# EasyEDA Pro project VoidX-Mini-Stomp-X.eprj, board NEW_PCB
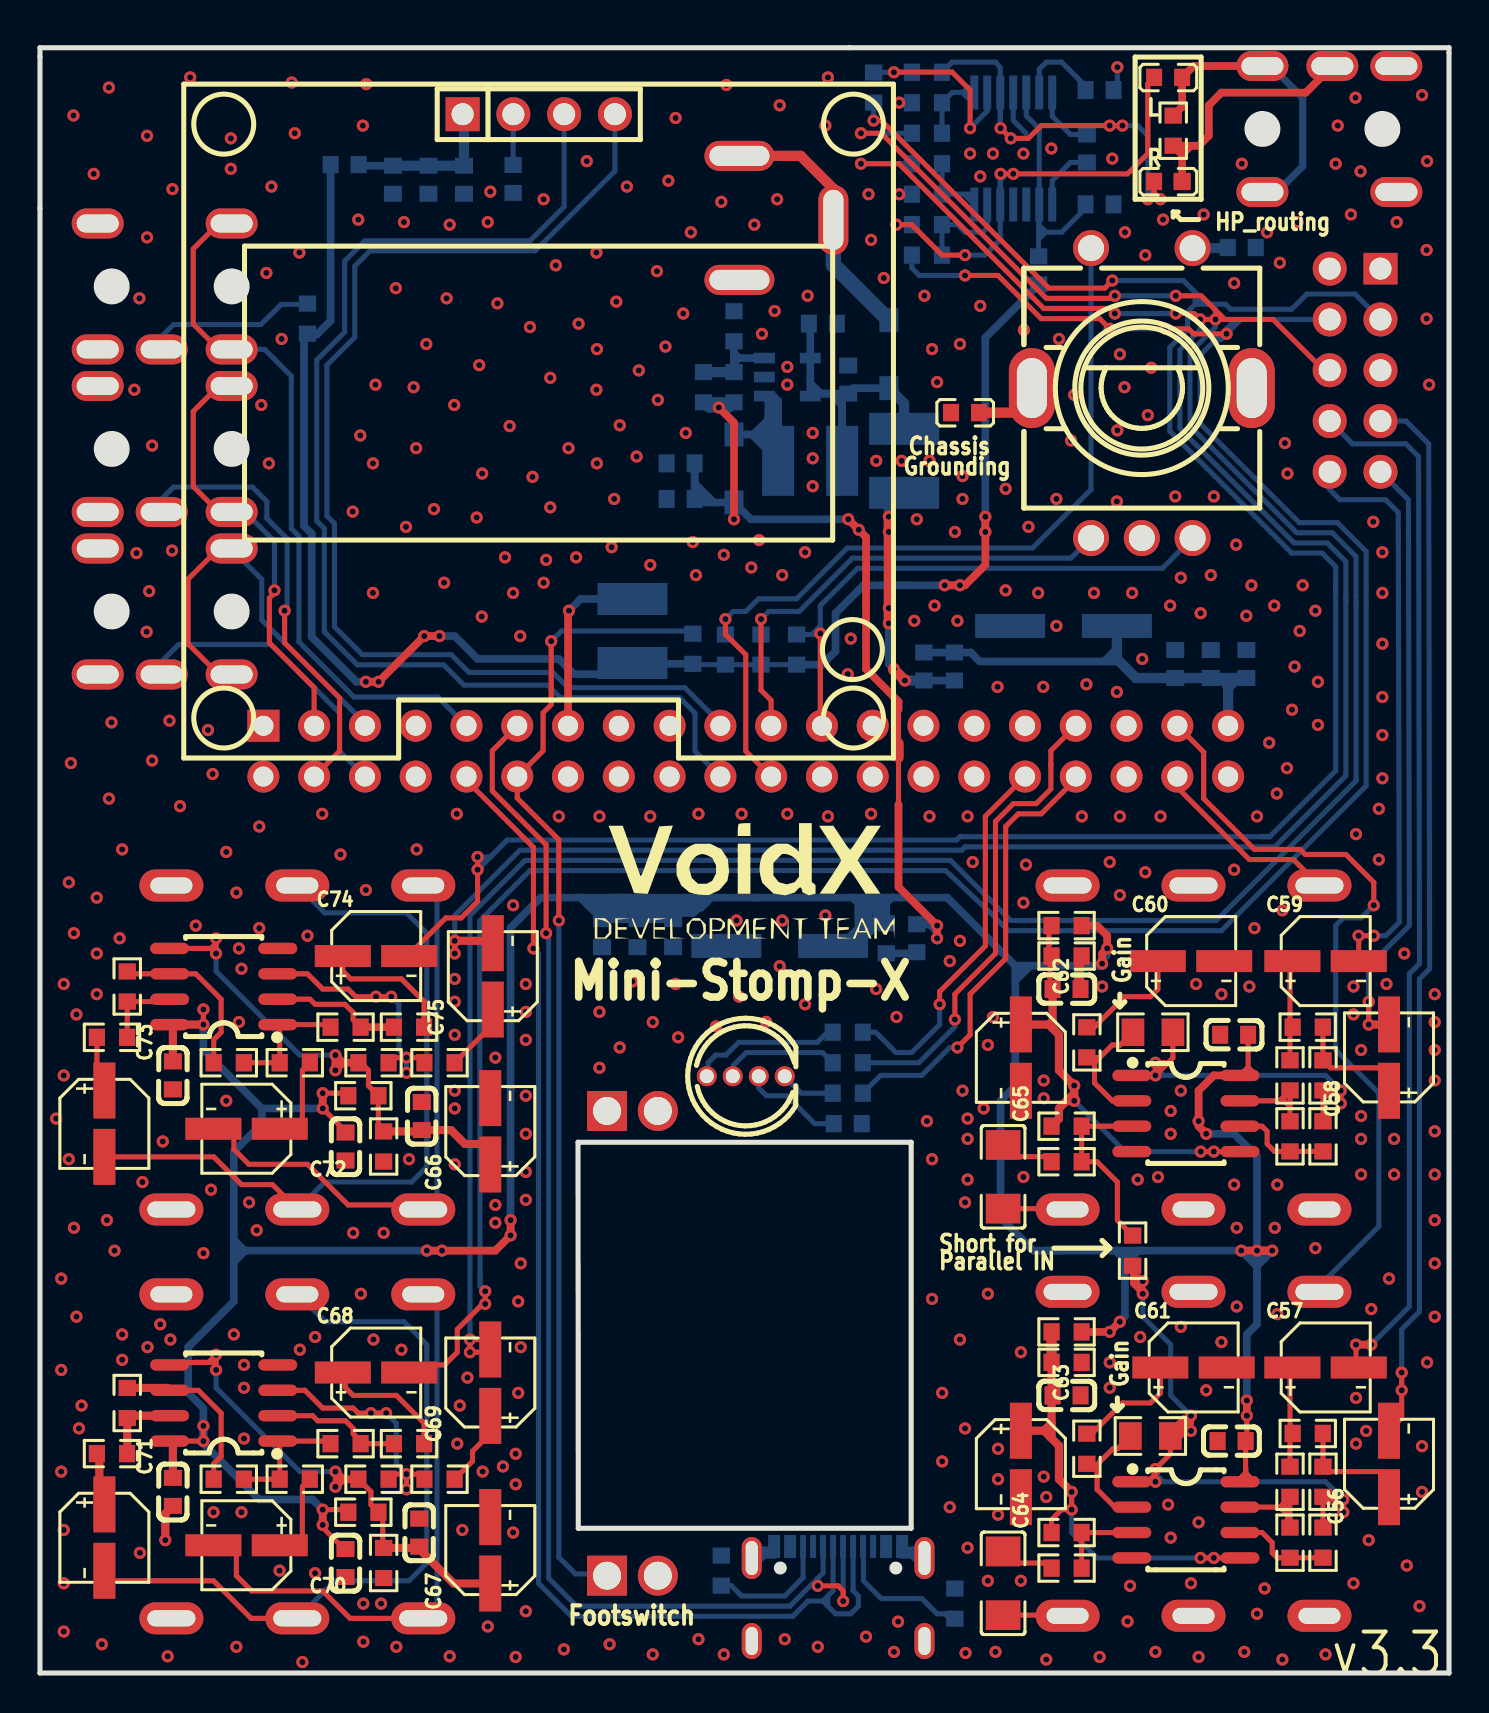
[diagram p1: board, top side]
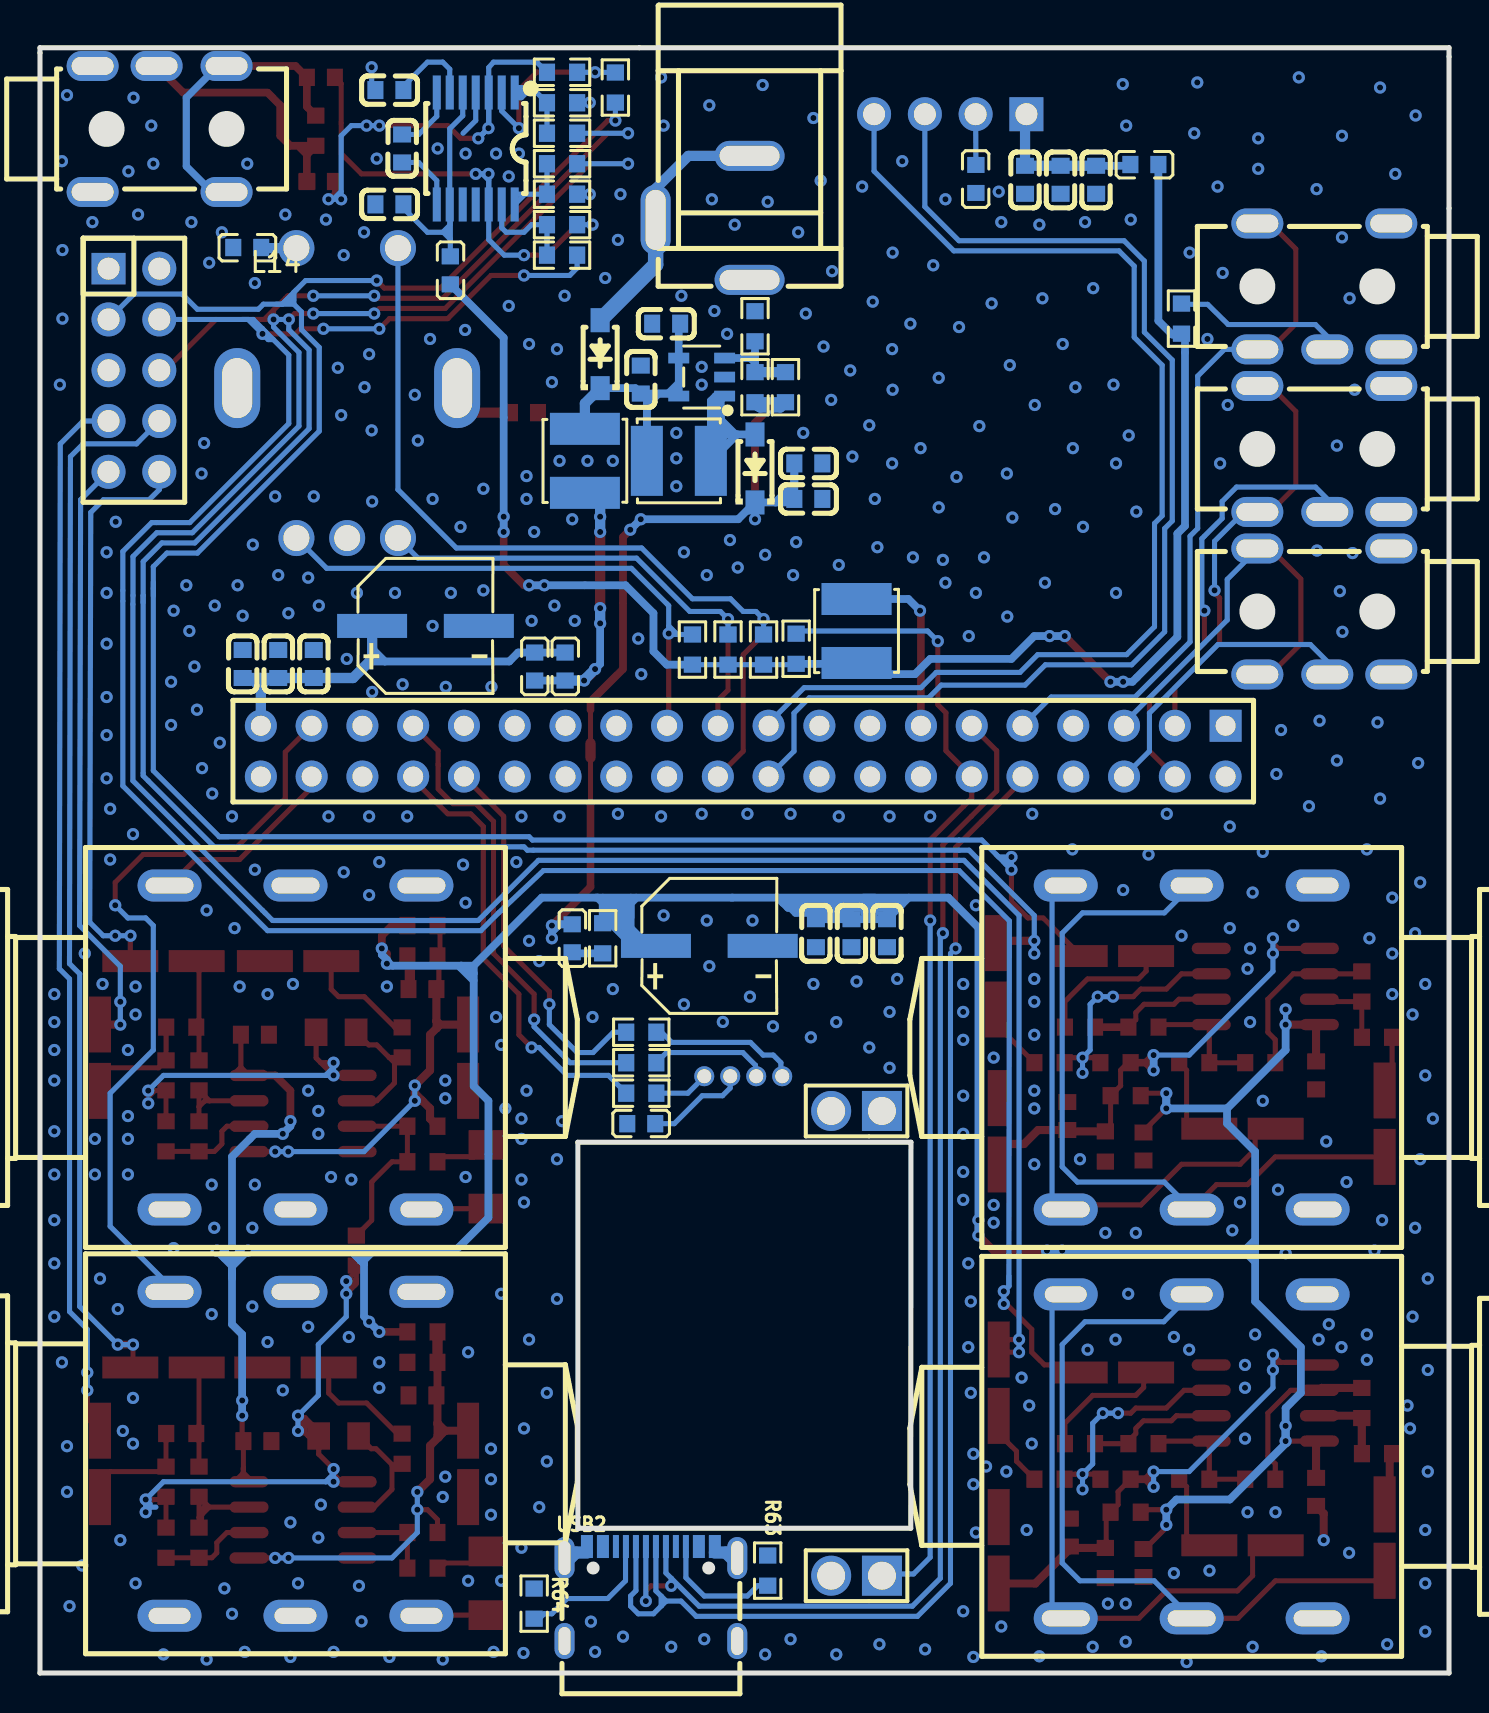
[diagram p2: board, bottom side, seen from below]

Outline 70.48 x 81.28 mm; copper layers: Top Layer, Bottom Layer. Coordinates in mm from the lower left corner of the outline.
Outline path: 0,81.28 0,0 70.48,0 70.48,81.28 0,81.28 ; 26.92,26.54 43.58,26.54 43.58,7.24 26.93,7.24 26.92,26.54
Stack: Top Layer 0.035mm / Dielectric1 1.51mm FR4 er 4.5 / Bottom Layer 0.035mm

## Design rules (mm)
spacing Default (default): track to track 0.152, other pairs 0 to 0.152
track width Default (default): min 0.254, default 0.254, max 25.4
differential pair differentialPair (default): width min 0.127, default 0.254, max 2.54; gap min 0.152, default 0.152
via Default (default): diameter min 0.605, default 0.605, max 100.025; hole min 0.305, default 0.305, max 59.995
net GND uses gge24461(1)
net ISOLATE_HP uses gge193373
net ISOLATE_DRE uses gge193508
pour e831 uses gge24461
pour e832 uses gge193373
pour e1608 uses gge24461(1)

## Placement (name value [footprint] x y rotation side)
C3  10uF  [C0603]  17.65 74.68 90 bottom
C4  100nF  [C0603]  21.21 74.68 90 bottom
C5  1uF  [C0603]  19.43 74.68 90 bottom
C6  220uF  [CAP-SMD_BD6.3-L6.6-W6.6-FD]  51.2 52.36 180 bottom
C8  1uF  [C0603]  29.89 37 90 bottom
C9  100nF  [C0603]  31.67 37 90 bottom
C10  10uF  [C0603]  28.11 37 90 bottom
C11  100nF  [C0603]  51.35 13.88 180 top
C15  1uF  [C0603]  6.65 29.89 90 top
C16  100nF  [C0603]  15.29 26.33 90 top
C18  100nF  [C0603]  51.35 34.2 180 top
C21  1uF  [C0603]  59.61 11.6 0 top
C22  1uF  [C0603]  59.74 31.92 0 top
C27  10uF  [C0603]  40.43 64.68 270 bottom
C28  1uF  [C0603]  39.16 67.48 0 bottom
C32  100nF  [C0603]  19.1 27.85 90 top
C35  10uF  [C0603]  32.05 60.49 0 bottom
C37  1uF  [C0603]  53.01 79.16 0 bottom
C39  10uF  [C0603]  56.79 50.46 270 bottom
C40  100nF  [C0603]  60.35 50.46 270 bottom
C41  1uF  [C0603]  58.57 50.46 270 bottom
C42  100nF  [C0603]  18.97 7.02 90 top
C45  100nF  [C0603]  15.29 5.5 90 top
C46  1uF  [C0603]  6.65 9.06 90 top
C48  1uF  [C0603]  32.05 58.71 0 bottom
C49  1uF  [C0603]  52.37 76.24 270 bottom
C50  1uF  [C0603]  53.01 73.45 0 bottom
C55  220uF  [CAP-SMD_BD6.3-L6.6-W6.6-FD]  37 36.36 180 bottom
C56  10uF  [CAP-SMD_BD4.0-L4.3-W4.3-LS5.0-FD]  67.48 10.45 90 top
C57  10uF  [CAP-SMD_BD4.0-L4.3-W4.3-LS5.0-FD]  64.31 15.28 0 top
C58  10uF  [CAP-SMD_BD4.0-L4.3-W4.3-LS5.0-FD]  67.48 30.77 90 top
C59  10uF  [CAP-SMD_BD4.0-L4.3-W4.3-LS5.0-FD]  64.31 35.6 0 top
C60  10uF  [CAP-SMD_BD4.0-L4.3-W4.3-LS5.0-FD]  57.58 35.6 0 top
C61  10uF  [CAP-SMD_BD4.0-L4.3-W4.3-LS5.0-FD]  57.7 15.28 0 top
C62  10uF  [CAP-SMD_BD4.0-L4.3-W4.3-LS5.0-FD]  49.07 30.77 270 top
C63  10uF  [CAP-SMD_BD4.0-L4.3-W4.3-LS5.0-FD]  49.07 10.45 270 top
C64  100nF  [C1206]  48.18 4.49 270 top
C65  100nF  [C1206]  48.18 24.82 270 top
C66  10uF  [CAP-SMD_BD4.0-L4.3-W4.3-LS5.0-FD]  22.52 27.09 90 top
C67  10uF  [CAP-SMD_BD4.0-L4.3-W4.3-LS5.0-FD]  22.52 6.14 90 top
C68  10uF  [CAP-SMD_BD4.0-L4.3-W4.3-LS5.0-FD]  16.81 15.03 0 top
C69  10uF  [CAP-SMD_BD4.0-L4.3-W4.3-LS5.0-FD]  22.52 14.52 90 top
C70  10uF  [CAP-SMD_BD4.0-L4.3-W4.3-LS5.0-FD]  10.33 6.39 180 top
C71  10uF  [CAP-SMD_BD4.0-L4.3-W4.3-LS5.0-FD]  3.22 6.77 270 top
C72  10uF  [CAP-SMD_BD4.0-L4.3-W4.3-LS5.0-FD]  10.33 27.22 180 top
C73  10uF  [CAP-SMD_BD4.0-L4.3-W4.3-LS5.0-FD]  3.22 27.47 270 top
C74  10uF  [CAP-SMD_BD4.0-L4.3-W4.3-LS5.0-FD]  16.81 35.85 0 top
C75  10uF  [CAP-SMD_BD4.0-L4.3-W4.3-LS5.0-FD]  22.65 34.84 90 top
D1  B5819W_C8598  [SOD-123_L2.7-W1.6-LS3.7-RD-1]  42.46 65.95 90 bottom
D2  B5819W_C8598  [SOD-123_L2.7-W1.6-LS3.7-RD-1]  34.72 60.24 90 bottom
DC2  DC-470-2.1GP  [DC-IN-TH_DC-470-2.1GP]  37.34 72.77 270 bottom
H1  PZ254V-11-02P  [HDR-TH_2P-P2.54-V-M]  29.64 4.87 0 bottom
H2  PM254V-12-10P-H85  [HDR-TH_10P-P2.54-V-F-R2-C5-S2.54]  65.79 65.15 270 bottom
H3  PZ254V-11-02P  [HDR-TH_2P-P2.54-V-M]  29.64 28.11 0 bottom
J1  PJ313D  [AUDIO-TH_PJ313D]  6.24 61.21 0 bottom
J2  PJ313D  [AUDIO-TH_PJ313D]  6.24 53.09 0 bottom
J3  PJ313D  [AUDIO-TH_PJ313D]  6.24 69.34 0 bottom
J4  PJ313D  [AUDIO-TH_PJ313D]  64.5 77.22 180 bottom
J5  PJ-609BA  [AUDIO-TH_PJ-609BA]  57.7 31.28 180 bottom
J6  PJ-609BA  [AUDIO-TH_PJ-609BA]  57.7 10.96 180 bottom
J7  PJ-609BA  [AUDIO-TH_PJ-609BA]  12.87 31.28 0 bottom
J8  PJ-609BA  [AUDIO-TH_PJ-609BA]  12.87 10.84 0 bottom
L1  600Ω  [L0603]  15.24 75.44 0 bottom
L2  600Ω  [L0603]  43.86 36.74 270 bottom
L3  600Ω  [L0603]  45.74 50.33 270 bottom
L4  600Ω  [L0603]  44.22 50.33 270 bottom
L5  10uH  [IND-SMD_L4.0-W4.0]  38.53 60.62 0 bottom
L6  600Ω  [L0603]  40.41 27.47 180 bottom
L7  600Ω  [L0603]  49.96 70.14 270 bottom
L8  600Ω  [L0603]  56.43 79.8 180 top
L9  600Ω  [L0603]  56.43 74.59 180 top
L10  600Ω  [L0603]  46.27 63.03 180 top
L11  600Ω  [L0603]  23.67 74.72 90 bottom
L12  10uH  [IND-SMD_L4.0-W4.0]  43.23 60.62 90 bottom
L13  10uH  [IND-SMD_L4.0-W4.0]  29.64 52.11 90 bottom
L14  600Ω  [L0603]  60.12 71.29 0 bottom
LED1  TJ-L5FYTXHMCSLCRGB-A5  [LED-TH_4P-BD5.8-P1.30]  35.31 29.84 0 top
NOREF  -  [Pad_e1610]  57.13 74.59 270 top
OLED1  -  [1.3-OLED-BLUE]  24.89 64.01 0 top
P1  Header-Female-2.54_2x20  [HDR-TH_40P-P2.54-V-F-R2-C20-S2.54]  35.31 46.1 0 bottom
R1  56kΩ  [R0603]  44.37 77 0 bottom
R2  56kΩ  [R0603]  41.7 79.29 90 bottom
R3  22kΩ  [R0603]  51.35 15.53 180 top
R4  22kΩ  [R0603]  51.35 17.06 180 top
R5  4.7Ω  [R0603]  42.34 36.74 90 bottom
R6  22kΩ  [R0603]  51.35 37.38 180 top
R7  22kΩ  [R0603]  51.35 35.85 180 top
R8  680Ω  [R0603]  32.66 51.22 90 bottom
R9  1MΩ  [R0603]  51.35 7.03 0 top
R10  1MΩ  [R0603]  51.35 27.35 0 top
R11  180Ω  [R0603]  40.41 29 180 bottom
R12  22kΩ  [R0603]  44.37 80.05 180 bottom
R13  470Ω  [R0603]  40.41 30.52 180 bottom
R14  470Ω  [R0603]  40.41 32.04 180 bottom
R15  470Ω  [R0603]  37.85 51.18 270 bottom
R16  470Ω  [R0603]  36.07 51.18 270 bottom
R17  470Ω  [R0603]  34.29 51.18 270 bottom
R18  100kΩ  [R0603]  16.17 28.87 0 top
R19  47kΩ  [R0603]  16.68 30.52 0 top
R20  11kΩ  [R0603]  64.18 26.84 90 top
R21  11kΩ  [R0603]  62.53 26.84 270 top
R22  33kΩ  [R0603]  19.98 30.52 180 top
R23  100kΩ  [R0603]  16.17 8.04 0 top
R24  680Ω  [R0603]  64.18 29.89 90 top
R25  680Ω  [R0603]  62.53 29.89 90 top
R26  33kΩ  [R0603]  18.46 32.3 180 top
R27  47kΩ  [R0603]  15.29 32.3 0 top
R28  680Ω  [R0603]  12.75 30.52 0 top
R29  22kΩ  [R0603]  44.37 72.43 180 bottom
R30  180Ω  [R0603]  13.38 67.73 90 bottom
R31  100kΩ  [R0603]  17.19 26.33 90 top
R32  100kΩ  [R0603]  17.19 5.5 90 top
R33  22kΩ  [R0603]  9.44 30.52 0 top
R34  22kΩ  [R0603]  4.36 34.33 90 top
R35  3.3kΩ  [R0603_NEW]  51.35 5.25 0 top
R36  11kΩ  [R0603]  62.53 6.52 270 top
R37  11kΩ  [R0603]  64.18 6.52 90 top
R38  240Ω  [R0603]  34.72 67.35 270 bottom
R39  680Ω  [R0603]  62.53 9.57 90 top
R40  680Ω  [R0603]  64.18 9.57 90 top
R41  680Ω  [R0603]  3.6 31.79 180 top
R42  680Ω  [R0603]  3.6 10.97 180 top
R43  22kΩ  [R0603]  4.36 13.5 90 top
R44  22kΩ  [R0603]  9.44 9.69 0 top
R45  47kΩ  [R0603]  15.29 11.47 0 top
R46  33kΩ  [R0603]  18.46 11.47 180 top
R47  3.3kΩ  [R0603_NEW]  51.35 25.57 0 top
R48  3.3kΩ  [R0603_NEW]  34.72 64.3 270 bottom
R49  33kΩ  [R0603]  19.98 9.69 180 top
R50  47kΩ  [R0603]  16.68 9.69 0 top
R51  680Ω  [R0603]  12.75 9.69 0 top
R52  3.3kΩ  [R0603_NEW]  63.42 32.3 180 top
R53  3.3kΩ  [R0603_NEW]  63.42 11.98 180 top
R54  22kΩ  [R0603]  44.37 78.53 0 bottom
R55  22kΩ  [R0603]  44.37 73.95 0 bottom
R56  56kΩ  [R0603]  44.37 75.48 180 bottom
R57  3.3kΩ  [R0603_NEW]  52.37 31.54 90 top
R58  3.3kΩ  [R0603_NEW]  52.37 11.22 90 top
R59  56kΩ  [R0603]  44.37 70.91 180 bottom
R60  0Ω  [R0805]  55.67 32.04 0 top
R61  0Ω  [R0805]  55.55 11.85 0 top
R62  11kΩ  [R0603]  33.19 64.3 90 bottom
R63  5.1kΩ  [R0603]  34.08 5.12 270 bottom
R64  5.1kΩ  [R0603]  45.77 3.47 270 bottom
R_DRE  DRE_ENABLE  [R0603]  54.66 21.12 90 top
R_HP  HP_ROUTER  [R0603]  56.69 77.13 90 top
SW1  EC11E1534408  [SW-TH_EC11XXXXXXXX]  55.12 64.01 0 top
U1  DSP_MODULE_PRO_PLACEHOLDER  [DSP_MODULE_PRO_FOOTPRINT]  38.99 58.42 0 top
U2  TL072IDR  [SOIC-8_L5.0-W4.0-P1.27-LS6.0-BL]  9.19 13.5 90 top
U3  TPA6138A2PWR  [TSSOP-14_L5.0-W4.4-P0.65-LS6.4-BL]  48.69 76.24 0 bottom
U4  TL072IDR  [SOIC-8_L5.0-W4.0-P1.27-LS6.0-BL]  9.19 34.33 90 top
U5  TL072IDR  [SOIC-8_L5.0-W4.0-P1.27-LS6.0-BL]  57.32 27.98 270 top
U7  TL072IDR  [SOIC-8_L5.0-W4.0-P1.27-LS6.0-BL]  57.32 7.66 270 top
U9  AP3012KTR-G1  [TSOT-23-5_L2.9-W1.6-P0.95-LS2.8-BL]  37.38 64.81 90 bottom
USB2  TYPE-C16PIN  [USB-C-SMD_TYPE-C16PIN]  39.92 3.96 180 bottom

## Footprints (pads in the part's own frame, mm; a bottom-side part is the same pattern mirrored in y, then rotated)
1.3-OLED-BLUE
  rect 1.7x1.7 hole 1.1: 1(-3.751,13.947)
  round 1.7 hole 1.1: 2(-1.211,13.947) 3(1.329,13.947) 4(3.869,13.947)
AUDIO-TH_PJ313D
  oval 2.6x1.5 hole 2.1x0.9: 2(-3.35,-3.15) 2(-3.35,3.15) 3(-0.15,3.15) 4(3.35,-3.15) 4(3.35,3.15)
AUDIO-TH_PJ-609BA
  oval 3.2x1.6 hole 2.1x0.8: 2(-6.3,-8.1) 4(0,-8.1) 6(6.3,-8.1)
  oval 3.2x1.6 hole 2.4x0.8: 3(-6.3,8.1) 5(0,8.1) 7(6.3,8.1)
C0603
  rect 0.8x0.9 smd: 1(-0.7,0) 2(0.7,0)
C1206
  rect 1.485x1.728 smd: 1(-1.593,0) 2(1.593,0)
CAP-SMD_BD4.0-L4.3-W4.3-LS5.0-FD
  rect 2.8x1.1 smd: 1(-1.661,0) 2(1.661,0)
CAP-SMD_BD6.3-L6.6-W6.6-FD
  rect 3.5x1.2 smd: 1(-2.67,0) 2(2.67,0)
DC-IN-TH_DC-470-2.1GP
  oval 1.5x3.5 hole 1x3: 1(3.1,2.35) 2(-3.1,2.35)
  oval 3.5x1.5 hole 3x1: 3(0.1,-2.35)
HDR-TH_2P-P2.54-V-M
  rect 2x2 hole 1.4: 1(-1.27,0)
  round 2 hole 1.4: 2(1.27,0)
HDR-TH_10P-P2.54-V-F-R2-C5-S2.54
  rect 1.575x1.7 hole 1.1: 1(-5.08,-1.27)
  round 1.7 hole 1.1: 2(-5.08,1.27) 3(-2.54,-1.27) 4(-2.54,1.27) 5(0,-1.27) 6(0,1.27) 7(2.54,-1.27) 8(2.54,1.27) 9(5.08,-1.27) 10(5.08,1.27)
HDR-TH_40P-P2.54-V-F-R2-C20-S2.54
  rect 1.6x1.6 hole 1: 1(-24.13,-1.27)
  round 1.6 hole 1: 2(-24.13,1.27) 3(-21.59,-1.27) 4(-21.59,1.27) 5(-19.05,-1.27) 6(-19.05,1.27) 7(-16.51,-1.27) 8(-16.51,1.27) 9(-13.97,-1.27) 10(-13.97,1.27) 11(-11.43,-1.27) 12(-11.43,1.27) 13(-8.89,-1.27) 14(-8.89,1.27) 15(-6.35,-1.27) 16(-6.35,1.27) 17(-3.81,-1.27) 18(-3.81,1.27) 19(-1.27,-1.27) 20(-1.27,1.27) 21(1.27,-1.27) 22(1.27,1.27) 23(3.81,-1.27) 24(3.81,1.27) 25(6.35,-1.27) 26(6.35,1.27) 27(8.89,-1.27) 28(8.89,1.27) 29(11.43,-1.27) 30(11.43,1.27) 31(13.97,-1.27) 32(13.97,1.27) 33(16.51,-1.27) 34(16.51,1.27) 35(19.05,-1.27) 36(19.05,1.27) 37(21.59,-1.27) 38(21.59,1.27) 39(24.13,-1.27) 40(24.13,1.27)
IND-SMD_L4.0-W4.0
  rect 1.6x3.5 smd: 1(-1.6,0) 2(1.6,0)
L0603
  rect 0.8x0.864 smd: 1(-0.7,0) 2(0.7,0)
LED-TH_4P-BD5.8-P1.30
  round 1 hole 0.7: 1(1.95,0) 2(0.65,0) 3(-0.65,0) 4(-1.95,0)
Pad_e1610
  rect 0.806x0.864 smd: 1(0,0)
R0603
  rect 0.806x0.864 smd: 1(-0.753,0) 2(0.753,0)
R0603_NEW
  rect 0.806x0.864 smd: 1(-0.753,0) 2(0.753,0)
R0805
  rect 1.133x1.377 smd: 1(-1,0) 2(1,0)
SOD-123_L2.7-W1.6-LS3.7-RD-1
  rect 1.2x0.95 smd: 1(-1.7,0) 2(1.7,0)
SOIC-8_L5.0-W4.0-P1.27-LS6.0-BL
  oval 0.569x1.95 smd: 1(-1.905,-2.705) 2(-0.635,-2.705) 3(0.635,-2.705) 4(1.905,-2.705) 5(1.905,2.705) 6(0.635,2.705) 7(-0.635,2.705) 8(-1.905,2.705)
SW-TH_EC11XXXXXXXX
  oval 2.3x4 hole 1.5x3: 6(5.5,0.25) 7(-5.5,0.25)
  round 1.8 hole 1.3: A(-2.54,-7.25) B(2.54,-7.25) C(0,-7.25) D(-2.54,7.25) E(2.54,7.25)
TSOT-23-5_L2.9-W1.6-P0.95-LS2.8-BL
  rect 0.532x1.045 smd: 1(-0.95,-1.147) 2(0,-1.147) 3(0.95,-1.147) 4(0.95,1.147) 5(-0.95,1.147)
TSSOP-14_L5.0-W4.4-P0.65-LS6.4-BL
  rect 0.4x1.7 smd: 1(-1.95,-2.8) 2(-1.3,-2.8) 3(-0.65,-2.8) 4(0,-2.8) 5(0.65,-2.8) 6(1.3,-2.8) 7(1.95,-2.8) 8(1.95,2.8) 9(1.3,2.8) 10(0.65,2.8) 11(0,2.8) 12(-0.65,2.8) 13(-1.3,2.8) 14(-1.95,2.8)
USB-C-SMD_TYPE-C16PIN
  oval 1x2.1 hole 0.6x1.7: 1(-4.32,1.788) 2(4.32,1.788)
  oval 1x1.8 hole 0.6x1.4: 3(-4.32,-2.362) 4(4.32,-2.362)
  rect 0.6x1.15 smd: A1B12(-3.2,2.362) A4B9(-2.4,2.362) B1A12(3.2,2.362) B4A9(2.4,2.362)
  rect 0.3x1.15 smd: A5(-1.25,2.362) A6(-0.25,2.362) A7(0.25,2.362) A8(-1.75,2.362) B5(1.75,2.362) B6(0.75,2.362) B7(-0.75,2.362) B8(1.25,2.362)

## Nets
As in the schematic, except:
$1N177: J4.3 L9.1 NOREF.1 R_HP.1

Pads without a net: H2 5; H3 1 2; J1 2; J5 4 5; J6 4 5; P1 1 2; SW1 6; U3 11; USB2 A4B9 A8 B4A9 B8

## Via types
v1: diameter 0.61, hole 0.305, Top Layer to Bottom Layer, 609 vias
v2: diameter 0.605, hole 0.305, Top Layer to Bottom Layer, 10 vias

## Routing (per net, layer and track width the routed paths; a pad name or vN(x,y) marks a point on that pad's centre or on a via; arc(x,y) is an arc through that point)
3V3_JTAG: length 82.6
  Top Layer w0.384: v1(45.26,54.4) v1(46.02,54.4) 46.27,54.4 47.29,55.41 v1(47.29,57.06) v1(47.29,57.83) ; v1(16.3,49.57) v1(16.94,49.57) v1(19.22,51.86) v1(19.98,51.86)
  Bottom Layer w0.254: R8.1 32.7,50.43 R17.2 R16.2 R15.2
  Bottom Layer w0.384: 13.21,66.94 13.21,57.36 13.59,56.98 13.59,51.82 15.83,49.57 v1(16.3,49.57) v1(16.94,49.57) ; R15.2 39.13,50.43 39.8,51.09 39.8,53 41.19,54.4 v1(45.26,54.4) v1(46.02,54.4) ; R8.1 29.68,50.47 L13.1 29.08,49.95 26.72,49.95 25.95,50.71 21.89,50.71 20.75,51.86 v1(19.98,51.86) v1(19.22,51.86) ; L1.1 14.54,67.62 13.85,66.94 13.21,66.94 ; v1(47.29,57.06) v1(47.29,57.83) 47.29,66.78 L7.2
+5V: length 18
  Bottom Layer w0.384: 38.53,64.5 39.05,63.98 39.46,63.98 ; 39.54,63.98 40.13,63.4 L5.2 40.13,63.68 C27.2 ; C27.2 40.7,64.25 D1.1 ; C27.2 38.65,63.98 U9.5 U9.4 38.53,67.41 C28.1
  Bottom Layer w0.512: 43.23,62.6 43.23,63.49 42.46,64.25
AGND: length 240.6
  Top Layer w0.254: v1(58.8,67.69) v1(58.04,67.69) 57.74,67.99 v1(56.82,67.99) ; v1(58.8,67.69) 61.68,67.69 64.22,65.15 H2.6 ; v1(58.8,67.69) 58.8,68.16 ; v1(56.82,68.87) 58.08,68.87 58.21,68.75 58.8,68.16 ; 58.8,68.16 59.27,67.69 59.75,67.69 ; 20.75,36.44 v1(20.75,35.98) 20.75,36.44 ; 20.75,36.44 v1(20.75,36.62) ; 20.75,36.44 v1(20.75,36.62) ; 20.75,36.44 v1(20.75,36.62) ; v1(41.07,77) 42.08,77 50.34,68.75 53.64,68.75 v1(53.77,68.87) ; v1(53.77,67.99) 53.51,68.24 50.21,68.24 42.97,75.48 v1(41.07,75.48) ; v1(21.51,16.68) 22.03,16.68 C69.2 22.39,16.04 v1(21.51,16.04) v1(21.51,16.68)
  Top Layer w0.406: C75.2 22.53,36.62 v1(20.75,36.62)
  Bottom Layer w0.254: v1(20.75,36.62) 20.75,37.89 24.01,41.15 46.11,41.15 46.27,41.32 61.77,41.32 65.32,44.87 65.32,53.89 ; v1(20.75,36.62) v1(20.75,35.98) v1(20.75,36.62) ; 65.32,53.89 65.33,53.52 ; 65.32,53.89 65.32,55.58 64.39,56.52 62.74,56.52 57.02,62.23 57.02,66.17 58.04,67.18 v1(58.04,67.69) v1(58.8,67.69) 58.8,67.31 57.53,66.04 57.53,62.36 62.86,57.02 64.64,57.02 65.83,55.83 65.83,53.89 65.84,53.44 65.84,44.62 58.85,37.63 48.56,37.63 45.55,40.64 24.26,40.64 21.51,37.89 v1(21.51,16.68) ; v1(41.07,75.48) R56.2 ; v1(53.77,68.87) v1(56.82,68.87) ; 53.77,67.98 56.82,67.98 ; v1(41.07,77) R1.1 ; v1(21.51,16.04) v1(21.51,16.68) ; v1(21.51,16.68) 21.48,16.7
GND: length 9.8
  Top Layer w0.406: v1(6.27,6.64) 6.27,7.98 C46.1
  Top Layer w0.512: 51.98,35.85 51.98,34.26 51.93,34.2
  Bottom Layer w0.254: C37.2 53.89,79.35 v1(53.89,80.3) ; 49.32,77 48.69,77.64 U3.4
  Bottom Layer w0.61: 44.24,5.45 43.67,6.03 43.12,6.03 ; 36.72,6.03 36.18,6.03 35.6,5.45
  vias: v1(0.81,27.73) v1(1.06,19.73) v1(1.06,15.15) v1(1.06,10.07) v1(1.19,34.46) v1(1.19,29.89) v1(1.19,7.15) v1(1.19,4.49) v1(1.19,2.07) v1(1.44,39.54) v1(1.44,25.69) v1(1.55,45.51) v1(1.67,77.89) v1(1.7,37) v1(1.7,22.27) v1(1.82,32.93) v1(1.82,17.82) v1(1.95,12.23) v1(2.08,13.38) v1(2.69,74.97) v1(2.84,38.78) v1(2.84,35.98) v1(2.84,33.95) v1(3.09,1.44) v1(3.35,22.65) v1(3.45,79.29) v1(3.45,43.73) v1(3.58,47.54) v1(3.73,21.12) v1(3.98,36.74) v1(4.11,41.19) v1(4.11,16.93) v1(4.11,15.66) v1(4.72,64.18) v1(4.83,56.01) v1(4.97,68.75) v1(5,6.01) v1(5.13,24.55) v1(5.36,76.88) v1(5.36,71.8) v1(5.33,52.07) v1(5.46,54.1) v1(5.38,16.3) v1(5.61,61.38) v1(5.61,45.63) v1(6.02,17.44) v1(6.14,26.58) v1(6.39,0.84) v1(6.48,47.62) v1(6.52,16.68) v1(6.62,74.21) v1(6.6,56.13) v1(7.01,43.35) v1(7.51,79.8) v1(7.79,37.38) v1(8.17,21) v1(8.4,47.16) v1(8.56,24.17) v1(8.64,44.96) v1(8.68,8.04) v1(9.32,41.06) v1(9.32,28.62) v1(9.55,76.75) v1(9.55,75.22) v1(9.7,16.93) v1(9.83,39.03) v1(9.83,1.31) v1(9.95,36.24) v1(9.95,32.55) v1(10.08,35.22) v1(10.08,8.04) v1(10.21,15.41) v1(10.21,14.26) v1(10.21,11.72) v1(10.46,23.54) v1(10.84,22.14) v1(10.97,42.33) v1(10.97,37.25) v1(11.07,63.41) v1(11.32,70.02) v1(11.45,60.49) v1(11.58,74.34) v1(11.98,5.12) v1(12.09,66.72) v1(12.59,79.54) v1(12.75,77) v1(12.98,71.03) v1(13,16.17) v1(13.13,0.55) v1(13.38,36.87) v1(13.76,16.8) v1(13.76,4.99) v1(14.12,42.97) v1(15.03,40.93) v1(15.64,58.08) v1(15.67,22.01) v1(15.92,72.68) v1(16.02,61.89) v1(16.05,18.96) v1(16.15,77.38) v1(16.17,3.47) v1(16.17,1.56) v1(16.32,79.46) v1(16.3,39.16) v1(16.66,60.49) v1(16.66,54.02) v1(16.68,16.68) v1(16.79,64.43) v1(17.06,3.47) v1(17.19,22.01) v1(17.8,69.26) v1(17.83,1.31) v1(18.08,16.17) v1(18.21,72.56) v1(18.31,57.32) v1(18.46,25.69) v1(18.69,64.3) v1(18.82,61.25) v1(18.84,41.19) v1(19.33,66.46) v1(19.71,58.21) v1(20.21,54.52) v1(20.34,68.75) v1(20.49,72.43) v1(20.49,0.84) v1(20.72,63.41) v1(20.75,34.71) v1(20.75,33.57) v1(20.75,31.92) v1(20.75,29.12) v1(20.75,28.23) v1(20.75,25.44) v1(20.85,42.97) v1(20.87,11.47) v1(21,13.38) v1(21.13,7.15) v1(21.38,14.77) v1(21.84,57.79) v1(21.97,65.41) v1(22.12,59.98) v1(22.1,52.83) v1(22.14,10.07) v1(22.4,72.56) v1(22.4,2.33) v1(22.52,74.08) v1(22.78,30.77) v1(22.78,23.41) v1(22.78,22.52) v1(22.88,68.49) v1(23.16,10.33) v1(23.26,55.79) v1(23.49,62.36) v1(23.67,54.02) v1(23.67,38.39) v1(23.67,7.03) v1(23.8,10.96) v1(23.8,9.44) v1(23.8,0.8) v1(23.92,18.58) v1(23.92,14.01) v1(24.02,51.86) v1(24.05,20.49) v1(24.05,16.3) v1(24.3,34.46) v1(24.3,33.06) v1(24.3,31.66) v1(24.3,28.87) v1(24.3,26.96) v1(24.3,25.06) v1(24.3,23.66) v1(24.3,3.09) v1(24.51,67.31) v1(24.64,59.82) v1(25.19,73.7) v1(25.19,54.52) v1(25.32,55.67) v1(25.53,64.77) v1(25.53,58.29) v1(25.8,70.4) v1(25.95,42.84) v1(26.21,1.18) v1(26.44,61.25) v1(26.82,55.79) v1(26.95,67.48) v1(27.35,75.61) v1(27.61,34.71) v1(27.83,71.03) v1(27.86,66.21) v1(27.83,64.18) v1(27.86,60.49) v1(27.99,42.84) v1(27.99,33.06) v1(27.99,30.27) v1(28.49,1.44) v1(28.6,56.3) v1(28.72,58.71) v1(28.83,68.58) v1(29,62.4) v1(29,31.28) v1(29.36,74.34) v1(29.64,34.58) v1(29.85,60.83) v1(29.95,65.14) v1(30.53,55.41) v1(30.53,42.84) v1(30.65,32.55) v1(30.65,0.93) v1(30.86,70.1) v1(30.91,63.67) v1(31.29,66.33) v1(31.43,74.63) v1(31.8,77.76) v1(31.8,34.46) v1(31.92,31.79) v1(32.18,67.99) v1(32.3,62.02) v1(32.56,72.05) v1(32.66,56.56) v1(32.81,54.9) v1(32.94,42.97) v1(32.94,1.69) v1(33.82,32.34) v1(34.08,73.57) v1(34.21,55.92) v1(34.21,0.93) v1(34.34,79.42) v1(34.84,37.63) v1(34.97,33.82) v1(35.1,42.97) v1(35.58,55.29) v1(35.73,72.43) v1(35.97,56.66) v1(36.11,66.97) v1(36.33,32.56) v1(36.75,68.11) v1(36.88,73.7) v1(37,78.4) v1(37,35.35) v1(37.13,54.9) v1(37.13,37.63) v1(37.26,1.69) v1(37.38,65.32) v1(37.38,64.43) v1(37.38,42.97) v1(38.27,56.05) v1(38.27,33.44) v1(38.4,68.87) v1(38.65,62.02) v1(38.65,60.75) v1(38.65,59.35) v1(38.91,1.31) v1(39.29,77.38) v1(39.29,37.89) v1(39.42,79.8) v1(39.42,42.84) v1(40.41,49.95) v1(40.56,51.73) v1(41.32,1.82) v1(41.45,73.95) v1(41.58,71.67) v1(41.58,42.97) v1(41.83,60.62) v1(41.83,34.2) v1(42.21,69.76) v1(42.72,1.06) v1(42.85,32.81) v1(42.93,2.57) v1(42.98,78.54) v1(42.98,73.95) v1(43.1,60.62) v1(43.73,52.62) v1(43.86,57.7) v1(44.24,68.87) v1(44.37,27.6) v1(44.5,60.62) v1(44.5,42.84) v1(44.62,66.21) v1(44.62,25.69) v1(44.62,18.71) v1(44.75,53.38) v1(44.88,64.56) v1(45.13,14.01) v1(45.13,10.58) v1(45.51,35.6) v1(45.51,8.3) v1(45.77,57.06) v1(45.89,52.62) v1(46.02,66.46) v1(46.02,36.62) v1(46.02,16.68) v1(46.15,59.86) v1(46.15,58.71) v1(46.15,29.12) v1(46.27,23.54) v1(46.27,12.23) v1(46.3,1) v1(46.4,42.84) v1(46.4,27.73) v1(46.4,26.71) v1(46.4,24.68) v1(46.4,6.26) v1(46.53,75.99) v1(46.66,40.55) v1(47.04,74.84) v1(47.04,68.37) v1(47.2,28.23) v1(47.42,31.41) v1(47.42,18.96) v1(47.42,4.61) v1(47.67,75.99) v1(47.67,32.81) v1(47.8,1.06) v1(47.9,49.32) v1(47.92,11.22) v1(47.92,9.69) v1(47.92,7.91) v1(48.31,59.22) v1(48.31,54.14) v1(49.07,16.04) v1(49.07,4.61) v1(49.2,75.99) v1(49.22,67.17) v1(49.2,38.52) v1(49.2,24.81) v1(49.32,40.43) v1(49.45,57.32) v1(49.93,54.02) v1(50.19,49.32) v1(50.21,29.63) v1(50.21,28.74) v1(50.21,9.82) v1(50.34,8.8) v1(50.34,0.68) v1(50.59,76.24) v1(50.85,58.71) v1(50.85,52.36) v1(50.97,66.72) v1(51.58,61.64) v1(51.73,63.92) v1(52.12,42.84) v1(52.35,49.44) v1(52.73,54.02) v1(53.01,0.8) v1(53.13,34.33) v1(53.51,40.55) v1(53.51,15.53) v1(53.51,14.26) v1(53.64,75.73) v1(53.87,58.59) v1(53.87,49.06) v1(53.89,62.14) v1(54.02,65.95) v1(54.02,42.84) v1(54.02,38.9) v1(54.25,64.3) v1(54.27,72.05) v1(54.4,2.58) v1(54.53,4.36) v1(54.63,54.02) v1(54.91,24.68) v1(55.04,16.8) v1(55.14,50.71) v1(55.29,70.91) v1(55.29,40.05) v1(55.42,62.91) v1(55.59,65.27) v1(55.8,1.06) v1(55.93,24.81) v1(56.05,42.84) v1(56.18,72.68) v1(56.43,8.42) v1(56.54,53.38) v1(56.56,28.11) v1(56.56,26.96) v1(56.56,6.77) v1(56.79,58.84) v1(57.07,54.78) v1(57.07,29.12) v1(57.07,17.31) v1(57.58,4.49) v1(57.83,34.46) v1(57.96,7.53) v1(57.96,0.8) v1(58.06,53) v1(58.21,72.94) v1(58.34,14.14) v1(58.57,54.9) v1(58.72,58.84) v1(59.1,33.95) v1(59.1,16.55) v1(59.74,69.51) v1(59.74,40.17) v1(59.74,24.42) v1(59.84,56.43) v1(59.86,22.27) v1(59.86,18.33) v1(60.12,75.48) v1(60.24,1.06) v1(60.35,52.87) v1(60.5,34.33) v1(60.6,54.4) v1(60.75,37.25) v1(60.88,42.84) v1(60.88,2.96) v1(61.26,4.23) v1(61.39,72.05) v1(61.49,46.52) v1(61.74,53.38) v1(61.77,22.27) v1(61.87,43.98) v1(61.89,24.42) v1(61.89,17.95) v1(62.02,70.53) v1(62.15,38.14) v1(62.15,0.68) v1(62.28,61.51) v1(62.4,59.98) v1(62.38,45.25) v1(62.63,48.17) v1(62.76,50.33) v1(62.91,72.56) v1(63.01,52.11) v1(63.17,54.4) v1(63.8,53.13) v1(63.8,21.25) v1(63.93,49.57) v1(63.93,47.41) v1(64.31,0.93) v1(64.82,75.48) v1(64.92,77.38) v1(65.58,72.94) v1(65.7,34.33) v1(65.7,32.93) v1(65.7,4.49) v1(65.81,78.78) v1(65.83,41.95) v1(65.83,13.76) v1(65.83,11.47) v1(66.06,75.1) v1(66.09,31.16) v1(66.09,27.85) v1(66.09,26.71) v1(66.09,24.93) v1(66.34,12.11) v1(66.47,6.64) v1(66.59,18.2) v1(66.7,57.57) v1(66.98,43.22) v1(66.98,40.68) v1(67.15,56.05) v1(67.15,54.02) v1(67.15,51.48) v1(67.15,48.81) v1(67.15,46.9) v1(67.15,44.74) v1(67.36,34.46) v1(67.48,19.73) v1(67.74,26.71) v1(67.74,24.93) v1(67.86,72.56) v1(68.24,35.98) v1(68.37,5.37) v1(69.01,3.34) v1(69.13,78.91) v1(69.13,11.34) v1(69.13,9.06) v1(69.36,71.16) v1(69.36,67.73) v1(69.39,75.61) v1(69.39,15.53) v1(69.49,64.43) v1(69.77,33.95) v1(69.77,32.55) v1(69.77,31.16) v1(69.77,29.63) v1(69.77,27.09) v1(69.77,24.93) v1(69.77,22.65) v1(69.77,20.49) v1(69.77,17.82)
VDD_IN_PAD: length 19.5
  Top Layer w0.508: 39.69,72.67 39.69,74.23 38.05,75.87 DC2.2
  Bottom Layer w0.508: DC2.2 38.05,75.87 39.69,74.23 39.69,72.67
  Bottom Layer w0.768: 42.46,67.65 39.69,70.43 39.69,72.16
DEBUG_D+: length 65
  Top Layer w0.254: v2(38.91,4.36) 39.92,4.36 40.18,4.1 v2(40.18,3.6) ; P1.11 22.63,46.12 22.63,44.11 25.32,41.42 v1(25.32,37)
  Bottom Layer w0.254: v1(25.32,37) 25.45,36.87 25.45,4.74 26.84,3.34 37.51,3.34 38.91,4.74 ; 38.91,4.74 39.17,5.01 39.17,6.03 ; 38.91,4.74 v2(38.91,4.36) ; 40.17,6.03 40.18,6.02 v2(40.18,3.6)
DEBUG_D-: length 65.2
  Top Layer w0.254: v1(24.68,36.24) 24.68,41.29 21.34,44.64 P1.10
  Bottom Layer w0.254: 39.16,3.6 39.41,3.84 ; 39.16,3.6 38.42,3.6 37.66,2.83 26.59,2.83 24.94,4.49 24.94,35.98 v1(24.68,36.24) ; 39.16,3.6 39.4,3.36 ; 39.41,3.84 39.41,3.37 39.4,3.36 ; 39.41,3.84 39.67,4.11 39.67,6.03 ; 40.67,6.03 40.67,4.12 40.94,3.85 40.94,3.34 40.56,2.96 39.8,2.96 39.4,3.36
ESPR_READ: length 35.1
  Top Layer w0.254: 8.94,66.19 7.67,67.47 7.67,71.22 8.94,72.49
  Bottom Layer w0.254: P1.9 19.9,48.81 15.71,48.81 12.95,51.56 12.95,56.86 12.57,57.24 12.57,64.86 11.24,66.19 8.94,66.19
FOOTSWITCH_READ: length 57.4
  Top Layer w0.254: v1(25.95,37.63) 25.95,41.67 24.28,43.35 23.88,43.75 P1.12 25.17,46.12 25.17,48.02 25.57,48.43 v1(25.57,51.6)
  Bottom Layer w0.254: v1(25.57,51.6) 26.08,52.11 32.52,52.11 32.66,51.98 ; v1(25.95,37.63) 25.95,5.79 26.79,4.95 28.32,4.95
GPIN_0: length 42.6
  Top Layer w0.254: P1.22 35.31,46.1 35.31,50.93 34.29,51.94 v1(34.29,52.7)
  Bottom Layer w0.254: 52.58,71.26 52.58,59.18 49.66,56.26 40.39,56.26 37.85,53.72 35.94,53.72 35.31,53.09 34.67,53.09 v1(34.29,52.7) R17.1
GPIN_1: length 24.5
  Top Layer w0.254: v1(36.07,52.7) 36.07,49.15 36.58,48.64 P1.21
  Bottom Layer w0.254: R16.1 v1(36.07,52.7) 36.45,53.09 37.98,53.09 40.64,55.75 51.57,55.75 SW1.A
GPIN_3: length 28.6
  Top Layer w0.254: v1(39.04,51.98) 39.04,47.45 P1.23
  Bottom Layer w0.254: 39.04,52.36 38.61,51.93 R15.1 38.99,51.94 v1(39.04,51.98) 39.04,53.38 39.12,53.46 40.9,55.25 56.14,55.25 SW1.B
GPOUT_2: length 19
  Top Layer w0.254: P1.32 47.29,42.84 47.29,36.36 45,34.08 v1(45,33.44)
  Bottom Layer w0.254: R14.1 41.8,32.04 42.82,31.03 43.61,31.03 45,32.43 v1(45,33.44)
GPOUT_4: length 22.4
  Top Layer w0.254: v1(45.89,31.28) 46.53,31.92 46.53,33.95 48.31,35.73 48.31,42.33 48.94,42.97 50.08,42.97 51.82,44.7 P1.34
  Bottom Layer w0.254: R11.1 42.05,29.89 44.11,29.89 45.51,31.28 v1(45.89,31.28)
GPOUT_7: length 23.7
  Top Layer w0.254: v1(45.77,32.68) 45.77,33.95 47.8,35.98 47.8,42.59 ; 47.8,42.59 47.8,42.6 ; 47.8,42.59 48.69,43.47 49.83,43.47 50.57,44.21 50.57,45.47 ; 50.57,45.35 50.57,46.12 P1.33
  Bottom Layer w0.254: R13.1 43.97,30.52 45.77,32.32 v1(45.77,32.68)
HEADPHONES_L: length 24.2
  Top Layer w0.254: L8.2 55.42,79.48 55.42,75.99 54.4,74.97 v1(48.69,74.97) v1(48.05,74.97) ; v1(42.85,72.43) 43.61,72.43 45.13,70.91 v1(46.27,70.91)
  Bottom Layer w0.254: U3.12 48.04,74.65 48.35,74.97 ; U3.12 48.04,74.96 v1(48.05,74.97) v1(48.69,74.97) ; U3.12 48.04,71.68 47.26,70.91 v1(46.27,70.91) ; R29.2 v1(42.85,72.43)
HEADPHONES_R: length 27.3
  Top Layer w0.254: v1(53.51,77.38) 53.77,77.38 ; v1(53.51,77.38) 50.08,77.38 49.45,76.75 v1(48.56,76.75) v1(48.05,77.26) ; v1(53.51,77.38) v1(54.15,77.38) ; v1(56.05,73.7) 55.73,74.02 L9.2 55.73,74.02 ; v1(56.05,73.7) v1(55.42,73.7) ; v1(56.05,73.7) 55.87,73.7 55.64,73.92 ; 55.73,74.02 55.73,74.59 ; 55.73,74.02 v1(55.42,73.7) ; 55.73,74.02 v1(55.42,73.7)
  Bottom Layer w0.254: 48.04,77.27 v1(48.05,77.26) ; 48.04,77.27 U3.3 48.04,77.27 ; 48.04,77.27 v1(48.05,77.26) ; v1(48.05,77.26) v1(48.56,76.75) v1(48.05,77.26) ; 48.04,79.04 48.04,80.29 47.8,80.56 45.63,80.56 45.12,80.05 ; v1(53.51,77.38) v1(54.15,77.38) 54.91,77.38 55.42,76.88 v1(55.42,73.7) v1(56.05,73.7) 55.81,73.7 55.42,74.09
HV_VCC: length 51.2
  Top Layer w0.254: 42.95,48.17 42.95,43.45
  Top Layer w0.384: 42.95,48.17 42.95,48.58 41.32,50.21 41.32,56.81 40.96,57.17 v1(40.43,57.7) ; v1(34.72,57.7) 34.72,62.52 v1(33.95,63.29) ; 42.95,43.45 42.95,39.31 v1(44.88,37.38) v1(44.88,36.74)
  Top Layer w0.512: 42.95,46.5 42.95,45.78
  Bottom Layer w0.384: 44.88,37.06 44.5,37.44 43.86,37.44 44.81,37.44 v1(44.88,37.38) v1(44.88,36.74) ; 34.72,63.42 34.58,63.29 v1(33.95,63.29) ; C48.2 33.5,58.71 33.68,58.54 ; C48.2 C35.2 32.75,59.49 33.7,58.54 ; C48.2 32.93,58.54 D2.1 ; 40.96,57.17 v1(40.43,57.7) 35.56,57.7 D2.1 ; D2.1 v1(34.72,57.7)
  Bottom Layer w0.512: 33.46,63.29 R62.1 R48.2 34.45,63.29 v1(33.95,63.29) 33.46,63.29
  vias: v1(40.96,57.17)
I2C_SCL: length 59.9
  Bottom Layer w0.254: 26.22,77.95 26.22,73.33 24.52,71.63 16.26,71.63 15.24,70.61 15.24,67.06 13.84,65.66 13.84,57.62 14.22,57.24 14.22,52.07 15.88,50.42 20.19,50.42 21.21,49.4 25.4,49.4 26.04,48.77 32,48.77 32.77,48.01 32.77,46.1 P1.20
I2C_SDA: length 58
  Bottom Layer w0.254: OLED1.4 28.76,75.11 24.77,71.12 16.51,71.12 15.75,70.36 15.75,66.8 14.35,65.41 14.35,57.87 14.73,57.49 14.73,52.32 16.13,50.93 20.57,50.93 21.46,50.04 25.65,50.04 26.42,49.28 32.26,49.28 34.04,47.5 P1.19
IN1_L: length 53.3
  Top Layer w0.254: C57.2 65.83,15.42 v1(65.83,16.42)
  Top Layer w0.384: v1(65.83,16.42) v1(66.59,16.42)
  Bottom Layer w0.254: H2.8 65.66,61.47 68.33,61.47 68.96,60.83 69.01,35.48 68.5,34.97 68.5,18.33 v1(66.59,16.42) v1(65.83,16.42)
IN1_R: length 54
  Top Layer w0.254: v1(68.12,15.03) v1(68.12,14.14) 68.12,12.75 C56.2
  Bottom Layer w0.254: v1(68.12,14.14) v1(68.12,15.03) 68.12,17.19 69.01,18.07 69.01,34.71 69.52,35.22 69.47,61.47 68.33,62.61 H2.7
IN2_L: length 29.6
  Top Layer w0.254: C59.2 65.97,36.86 v1(65.96,36.87) v1(66.72,36.87)
  Bottom Layer w0.254: H2.10 64.52,59.18 65.02,58.67 67.31,58.67 67.95,58.04 68,37.54 67.32,36.87 v1(66.72,36.87) v1(65.96,36.87)
IN2_R: length 31.2
  Top Layer w0.254: v1(66.47,33.57) v1(66.47,32.43)
  Top Layer w0.406: C58.2 67.47,32.43 v1(66.47,32.43)
  Bottom Layer w0.254: v1(66.47,32.43) v1(66.47,33.57) 66.47,35.35 68.5,37.38 68.45,58.67 H2.9
JACK_DETECT_L: length 38.3
  Top Layer w0.254: P1.37 58.21,46.06 58.21,43.73 60.75,41.19 63.04,41.19 63.29,40.93 65.32,40.93 66.72,39.54 v1(66.72,38.39)
  Bottom Layer w0.254: v1(66.72,38.39) 66.09,37.76 65.2,37.76 64.82,37.38 64.82,31.16 66.98,29 66.98,22.34 63.85,19.21
JACK_DETECT_R: length 9.7
  Top Layer w0.254: P1.38 56.9,44.28 60.5,40.68 62.7,40.68 J5.3
MIDI_IN_4: length 22.6
  Top Layer w0.254: P1.4 14.99,46.1 14.99,48.77 12.24,51.52 v1(12.24,53.13)
  Bottom Layer w0.254: 5.44,58.06 6.68,59.31 10.63,59.31 11.35,58.59 11.35,57.74 12.36,56.72 12.36,53.25 v1(12.24,53.13)
MIDI_IN_5: length 19.7
  Top Layer w0.254: P1.3 13.72,49.28 11.48,51.52 11.48,53.76 11.73,54.02 v1(11.73,54.14) ; 8.94,64.36 7.67,63.09 7.67,59.34 8.94,58.06
  Bottom Layer w0.254: 10.26,58.06 11.73,56.6 v1(11.73,54.14)
MIDI_OUT_4: length 15.3
  Bottom Layer w0.254: 5.44,49.94 6.94,51.44 11.56,51.44 14.99,48.01 14.99,46.1 P1.6
MIDI_OUT_5: length 19.8
  Top Layer w0.254: 8.94,56.24 7.41,54.71 7.41,51.46 8.94,49.94
  Bottom Layer w0.254: P1.5 16.26,47.5 11.09,52.66 11.09,54.69 9.55,56.24 8.94,56.24
OPAMP_BIAS_L: length 24.4
  Top Layer w0.254: U5.5 v1(58.72,26.08) v1(58.06,26.08) ; 50.47,35.85 50.53,35.8 50.53,34.2 ; 50.47,37.38 50.47,35.85
  Top Layer w0.406: 50.65,32.61 50.65,32.24 ; 50.65,32.61 50.65,32.61 C18.2 ; 50.65,32.61 50.46,32.43 ; 50.65,32.24 50.46,32.43 ; 50.65,32.24 50.97,31.92 50.97,30.14 v1(51.73,29.38) 51.73,29 ; 50.46,32.43 49.08,32.43 C62.1 ; R10.1 50.97,27.72 50.97,28.23 51.35,28.62 ; 51.35,28.62 v1(51.73,28.62) 51.73,29 ; 51.35,28.62 51.73,29
  Bottom Layer w0.254: v1(58.72,26.08) v1(58.06,26.08) 54.27,26.08 v1(51.73,28.62) v1(51.73,29.38)
OPAMP_BIAS_R: length 25
  Top Layer w0.254: R9.1 50.6,7.67 51.1,8.17 v1(51.61,8.17) v1(51.61,9.06) ; U7.5 v1(58.72,5.76) v1(58.05,5.76)
  Top Layer w0.406: 50.6,12.5 R3.2 ; 50.6,12.5 50.22,12.12 ; 50.6,12.5 50.6,11.83 50.55,11.78 ; 50.22,12.12 C63.1 ; 50.22,12.12 50.55,11.78 ; v1(51.61,9.06) 50.97,9.69 50.97,11.36 50.55,11.78
  Top Layer w0.512: R4.2 R3.2
  Bottom Layer w0.254: v1(51.61,9.06) v1(51.61,8.17) 51.61,7.03 52.88,5.76 v1(58.05,5.76) v1(58.72,5.76)
OPAMP_VCC: length 243.9
  Top Layer w0.254: 60.31,10.22 60.31,10.01 ; 60.31,10.22 60.31,10.27 ; 60.31,10.22 60.31,10.01 ; 60.31,10.01 60.31,10.01 60.75,9.57 ; 60.31,10.01 60.31,10.22 60.31,10.27 ; v1(60.37,12.87) 60.37,11.66 C21.2 60.31,10.27 ; v1(14.14,7.41) 14.14,7.27 15.25,6.17 ; 60.85,29.89 60.44,30.29 ; 60.44,30.29 U5.8 ; 60.44,30.29 C22.2 ; v1(8.17,12.36) v1(8.17,11.6) U2.8 ; R18.1 15.29,29 v1(14.14,29) ; C16.2 15.29,27.09 v1(14.14,28.23) ; 60.31,10.01 60.31,9.85 U7.8 ; 60.31,10.01 59.86,9.57 ; v1(14.14,8.17) 15.29,8.17 R23.1 ; v1(8.17,33.19) v1(8.17,32.43)
  Top Layer w0.384: 52.11,17.06 v1(53.51,17.06) v1(54.02,17.57) ; v1(58.34,26.96) 57.96,27.35 v1(57.96,27.6) 57.96,29.12 58.72,29.89 U5.8 ; v1(60.09,21.12) v1(60.88,21.12) ; v1(60.88,21.12) v1(61.64,21.12) ; v1(60.88,21.12) v1(61.64,21.12) ; v1(60.88,21.12) v1(61.64,21.12) ; v1(14.14,28.23) v1(14.14,29) ; 51.98,37.38 52.88,37.38 53.39,36.87 v1(53.39,36.24) 53.13,35.98 v1(53.13,35.47) ; v1(23.54,22.65) v1(23.54,21.88) 22.78,21.12 v1(20.11,21.12) v1(19.35,21.12) ; v1(14.14,8.17) v1(14.14,7.41) ; 60.37,13.63 v1(60.37,12.87)
  Top Layer w0.406: C15.2 6.65,32.26 U4.8 v1(8.17,32.43) ; U2.8 6.65,11.43 C46.2
  Bottom Layer w0.254: 53.13,35.67 52.83,35.37 ; v1(8.17,33.19) v1(8.17,32.43) ; v1(53.39,36.24) 53.39,35.93
  Bottom Layer w0.384: v1(14.14,7.41) v1(14.14,8.17) 13.64,8.68 10.97,8.68 8.17,11.47 v1(8.17,12.36) ; 54.93,21.12 54.45,20.63 ; 54.93,21.12 55.25,21.12 ; 54.93,21.12 54.27,20.46 ; 54.45,20.63 53.96,21.12 53.57,21.12 ; 54.45,20.63 54.46,20.62 ; 54.45,20.63 54.27,20.46 ; v1(8.17,12.36) v1(8.17,11.6) v1(8.17,12.36) ; v1(8.17,12.36) 8.17,13.25 7.41,14.01 7.41,16.3 9.7,18.58 9.7,21.12 ; C10.2 28.11,38.01 27.61,38.52 ; 11.11,28.23 v1(14.14,28.23) ; 11.11,28.23 11.09,28.23 8.17,31.16 v1(8.17,32.43) ; 11.11,28.23 11.11,27.48 9.7,26.08 9.7,21.66 ; v1(14.14,28.23) v1(14.14,29) v1(14.14,28.23) ; C55.1 40.43,36.36 41.19,37.12 41.19,38.52 42.08,38.52 42.08,38.01 41.45,37.38 41.45,38.27 41.83,38.27 41.83,38.01 42.59,38.78 42.69,38.78 ; C55.1 40.05,36.36 40.94,37.25 40.94,38.78 ; C55.1 40.81,36.36 41.95,37.5 42.34,37.5 ; 29.95,38.01 32.68,38.01 32.94,38.27 32.94,38.52 ; 29.26,38.01 28.75,38.01 28.75,38.52 ; v1(60.09,21.12) v1(60.88,21.12) ; v1(60.09,21.12) 50.31,21.12 ; v1(60.09,21.12) v1(60.88,21.12) ; v1(60.09,21.12) 60.88,20.34 ; v1(60.88,21.12) v1(61.64,21.12) 60.88,20.36 ; v1(60.88,21.12) 61.27,20.75 ; v1(60.88,21.12) 60.88,25.82 59.74,26.96 v1(58.34,26.96) 57.96,27.35 v1(57.96,27.6) ; v1(60.88,21.12) 60.88,20.36 ; 10.27,21.12 9.7,20.55 ; 10.27,21.12 10.24,21.12 ; 10.27,21.12 v1(19.35,21.12) v1(20.11,21.12) ; 50.31,21.12 49.7,21.12 48.05,22.77 48.05,28.62 48.79,29.35 48.79,34.99 ; 50.31,21.12 51.07,21.12 ; 9.7,21.66 9.7,21.12 ; 9.7,21.66 10.24,21.12 ; 10.24,21.12 9.7,21.12 ; 49.39,35.37 49.01,34.99 48.79,34.99 ; 49.39,35.37 48.79,35.37 ; 49.39,35.37 49.44,35.37 ; 60.88,20.45 60.49,20.83 60.49,21.12 ; 60.88,20.36 60.88,20.34 ; 60.88,20.36 60.88,20.34 ; 27.73,38.52 33.33,38.51 ; 27.04,38.78 28.11,37.7 C8.2 C9.2 ; v1(60.37,12.87) v1(60.37,13.63) 60.37,16.93 60.88,17.44 60.88,19.91 ; R5.2 42.34,38.78 ; 49.44,35.37 49.44,35.27 48.79,34.62 ; 49.44,35.37 53.03,35.37 v1(53.13,35.47) 53.13,35.67 53.39,35.93 v1(53.39,36.24) ; 48.79,34.99 48.79,35.37 ; 54.27,20.46 54.27,17.84 v1(54.02,17.57) v1(53.51,17.06) ; 54.27,20.46 54.27,20.65 53.8,21.12 ; v1(23.54,21.88) v1(23.54,22.65) 23.54,37.27 25.04,38.78 45.39,38.78 48.79,35.37 ; 27.34,38.47 27.54,38.27 33.07,38.27 33.57,38.78 ; 60.88,20.34 60.88,19.91 ; 60.88,20.34 60.88,19.91 ; 40.94,37.79 40.94,38.49 40.65,38.78 ; 54.76,20.95 54.27,20.95 ; 30.75,38.52 29.87,38.52 ; 60.88,19.91 60.88,19.73 ; 29.3,38.78 28.72,38.78 ; 35.89,38.78 35.83,38.78
OUT_L: length 129.2
  Top Layer w0.254: v1(53.51,67.22) 53,67.73 50.08,67.73 47.92,69.89 v1(46.27,69.89) ; v1(22.27,19.09) v1(22.27,18.46) 22.14,18.46 20.87,17.19 20.87,16.04 20.24,15.41 18.85,15.41 C68.2 ; v1(59.36,66.97) 57.7,66.97 57.45,67.22 v1(56.31,67.22)
  Bottom Layer w0.254: v1(22.27,18.46) v1(22.27,19.09) 22.02,19.35 22.02,19.86 ; R59.2 43.62,70.26 43.99,69.89 v1(46.27,69.89) ; 59.36,67.24 59.36,67.23 v1(59.36,66.97) ; 22.02,19.34 21.99,36.72 21.99,37.61 24.51,40.13 45.3,40.13 47.54,38.01 48.43,37.12 59.1,37.12 66.34,44.36 66.34,56.09 64.9,57.53 62.99,57.53 58.04,62.48 58.04,65.91 59.82,67.69 H2.4 ; v1(53.51,67.22) v1(56.31,67.22) ; v1(59.36,66.97) 60.08,67.69 60.39,67.69 ; v1(59.36,66.97) 59.07,66.68 58.81,66.68
OUT_R: length 117.4
  Top Layer w0.254: v1(41.7,77.64) 42.08,77.64 50.46,69.26 53.26,69.26 v1(53.64,69.64) ; v1(21.89,40.81) v1(21.89,40.17) 21.89,38.59 21.06,37.76 20.3,37.76 18.59,36.05
  Bottom Layer w0.254: v1(21.89,40.81) 22.52,40.81 22.66,40.94 ; v1(21.89,40.81) 22.05,40.81 22.29,40.57 ; v1(21.89,40.81) v1(21.89,40.17) ; v1(21.89,40.81) 21.89,40.72 22.17,40.45 ; 58.68,68.45 58.38,68.45 57.67,69.16 ; v1(53.64,69.64) 57.2,69.64 57.79,69.05 57.79,68.45 ; 57.79,68.67 58.14,68.67 58.36,68.45 ; v1(21.89,40.17) 23.37,41.66 45.85,41.66 46.02,41.82 61.51,41.82 ; v1(21.89,40.17) 22.21,40.49 ; 57.79,68.45 59.31,68.45 59.56,68.2 62.61,68.2 63.37,68.96 65.79,68.96 H2.3 ; 57.79,68.45 57.4,68.07 57.4,67.18 56.52,66.29 56.52,62.1 62.61,56.01 64.14,56.01 64.82,55.33 64.82,53.87 ; R2.1 v1(41.7,77.64) ; 64.82,54.56 64.82,45.13 61.51,41.82 ; 61.51,41.82 61.05,41.82
$1N49: length 2.3
  Bottom Layer w0.254: 23.67,75.67 OLED1.2
$1N55: length 2.8
  Bottom Layer w0.254: 37.23,29.84 38.08,29 R11.2
$1N56: length 7.6
  Bottom Layer w0.254: 39.65,32.04 39.39,32.04 38.88,31.54 34.95,31.54 34.31,30.9 33.8,30.9 33.42,30.52 33.42,29.88 33.39,29.84
$1N57: length 6
  Bottom Layer w0.254: 39.65,30.52 39.15,31.03 35.33,31.03 34.69,30.39 34.69,29.87 34.67,29.84
$1N79: length 8.7
  Bottom Layer w0.254: 5.44,66.19 6.68,67.44 11.05,67.44 12.07,68.45 13.21,68.45
$1N88: length 1.5
  Bottom Layer w0.384: R5.1 43.81,35.99 L2.2
$1N89: length 15.5
  Top Layer w0.384: 42.95,49.95 42.72,50.18
  Top Layer w0.512: v1(42.46,57.83) v1(42.46,57.06) v1(42.46,53.25) v1(42.46,52.49) ; 43.27,49.63 42.72,50.18 v1(42.72,50.21)
  Bottom Layer w0.384: L4.2 L3.2 ; v1(42.46,52.49) 42.46,50.46 v1(42.72,50.21)
  Bottom Layer w0.512: L4.2 v1(43.27,49.63) 43.27,49.66 v1(42.72,50.21) ; v1(42.46,52.49) v1(42.46,53.25) ; v1(42.46,57.06) v1(42.46,57.83) 42.46,58.64 43.23,59.4
$1N90: length 23.6
  Bottom Layer w0.384: 53.23,50.59 47.01,50.59 46.57,51.03 45.74,51.03 ; 53.23,50.59 54,50.59 ; 53.23,50.59 53.87,51.22 53.87,51.22 53.87,52.36 ; 58.96,49.76 59.44,49.28 ; L4.1 L3.1
  Bottom Layer w0.512: 59.44,49.76 C41.2 C39.2 54.82,49.76 54,50.59 53.87,50.71 53.87,51.72 ; 59.44,49.76 59.92,49.76 ; 59.44,49.76 59.44,49.27 ; P1.39 59.44,49.27 ; 59.44,49.27 59.92,49.76 ; 59.92,49.76 C40.2
$1N94: length 7.9
  Bottom Layer w0.384: L1.2 16,75.38 C3.2
  Bottom Layer w0.508: 21.14,77.95 21.21,77.89 C4.2 C5.2 C3.2
$1N105: length 19.8
  Top Layer w0.254: 65.07,28.8 v1(65.07,29.12) 64.18,29.13 R20.2 ; 65.07,28.8 64.75,29.13 ; 65.07,28.8 v1(65.07,28.49) ; 56.19,30.52 v1(55.8,30.52) v1(55.8,29.89) ; 56.19,30.52 56.43,30.52 ; 56.19,30.52 56.01,30.34 56.01,30.09 ; R60.2 56.67,30.76 56.43,30.52 ; v1(55.8,29.89) U5.1 ; v1(55.8,29.89) 56.01,30.09 ; 56.01,30.09 56.43,30.52
  Bottom Layer w0.254: 56.2,29.89 v1(55.8,29.89) 55.8,30.29 ; 56.2,29.89 55.8,30.29 ; 56.2,29.89 64.31,29.89 v1(65.07,29.12) ; 55.8,30.29 v1(55.8,30.52)
$1N107: length 5
  Top Layer w0.254: U5.6 61.13,27.35 61.39,27.09 61.39,26.46 61.76,26.08 62.53,26.08 ; R21.2 R20.1
$1N108: length 3.9
  Top Layer w0.254: 62.01,28.62 61.04,28.62 ; 62.01,28.62 62.24,28.62 62.53,28.32 ; 62.01,28.62 R25.1 62.53,28.32 ; 62.53,28.32 R21.1
$1N109: length 6.3
  Top Layer w0.254: C58.1 67.48,29.89 67.1,30.27 64.55,30.27 64.18,30.64 64.17,32.55
$1N116: length 6
  Top Layer w0.254: C56.1 67.48,9.57 66.98,10.07 64.43,10.07 R40.2 64.18,11.97 R53.1
$1N117: length 6.4
  Top Layer w0.254: 62.53,7.78 62.4,7.91 ; 62.53,7.78 R39.1 62.01,8.3 ; 62.53,7.78 R36.1 62.4,7.4 62.4,7.91 ; 62.4,7.91 62.01,8.3 ; 62.4,7.91 62.4,8.17 62.28,8.3 62.01,8.3 ; 62.01,8.3 U7.7
$1N118: length 5
  Top Layer w0.254: 62.53,5.76 61.89,5.76 61.64,6.01 61.64,6.52 61.13,7.03 U7.6 ; R36.2 R37.1
$1N120: length 40.3
  Top Layer w0.254: v1(57.58,12.87) 57.56,12.87 ; v1(57.58,12.87) 57.51,12.8 ; v1(57.58,12.87) 57.56,12.87 ; 57.56,12.87 57.51,12.81 ; 57.23,12.77 57.23,12.54 ; 57.23,12.77 56.55,12.09 R61.2 ; 57.23,12.77 57.47,12.77 ; 57.23,12.54 57.22,12.53 ; 57.23,12.54 57.23,12.53 ; 57.23,12.54 57.47,12.77 ; 57.58,12.53 57.23,12.18 ; 57.58,12.53 57.23,12.53 ; 57.58,12.53 57.58,12.74 57.51,12.8 ; 57.58,12.53 v1(57.58,12.11) 57.48,12.01 57.23,12.01 ; 57.23,12.18 57.23,12.01 ; 57.23,12.18 57.23,12.53 ; 57.22,12.53 R61.2 ; 57.22,12.53 57.23,12.53 ; 57.51,12.81 57.51,12.8 ; 57.51,12.81 57.47,12.77 ; 65.2,8.33 64.85,8.68 ; 65.2,8.33 v1(65.2,8.68) 64.85,8.68 ; 65.2,8.33 v1(65.2,8.04) ; 64.85,8.68 64.32,8.68 R40.1 R37.2 ; 54.73,19.4 54.66,19.47 54.66,19.64 ; 54.73,19.4 54.96,19.4 ; 54.73,19.4 54.94,19.19 ; 57.23,12.01 57.07,11.85 56.55,11.85 ; 55.42,9.57 55.8,9.95 v1(55.8,10.2) ; 55.42,9.57 U7.1 ; 55.42,9.57 v1(55.8,9.57) v1(55.8,10.2) ; v1(55.16,19.6) v1(55.16,18.96) 54.94,19.19 ; v1(55.16,19.6) 55.13,19.64 ; v1(55.16,19.6) 54.96,19.4 ; R61.2 56.55,10.95 v1(55.8,10.2) ; 57.51,12.8 57.48,12.77 57.47,12.77 ; 54.66,20.11 R_DRE.1 ; 54.66,20.11 55.13,19.64 ; 54.66,20.11 54.66,19.64 ; 54.96,19.4 54.94,19.38 54.94,19.19 ; 55.13,19.64 54.66,19.64
  Bottom Layer w0.254: 55.8,9.96 v1(55.8,10.2) 55.8,9.96 ; 55.8,9.96 v1(55.8,9.57) 56.19,9.57 ; 55.8,9.96 56.19,9.57 ; v1(57.58,12.11) v1(57.58,12.87) 56.56,13.88 56.56,16.42 55.16,17.82 v1(55.16,18.96) v1(55.16,19.6) ; 65.2,8.22 v1(65.2,8.04) 64.94,8.3 64.69,8.3 ; 65.2,8.22 v1(65.2,8.68) 64.31,9.57 56.19,9.57 ; 65.2,8.22 64.97,8.45
$1N125: length 12.9
  Top Layer w0.254: 17.56,30.52 17.82,30.77 v2(18.33,30.77) 18.98,30.77 R22.2 ; U4.3 13.38,34.97 14.14,34.2 15.41,34.2 15.79,33.82 v2(16.81,33.82) v2(17.57,33.82)
  Bottom Layer w0.254: v2(16.81,33.82) v2(17.57,33.82) 17.95,33.44 17.95,31.16 v2(18.33,30.77) v2(18.33,30.01)
$1N126: length 27
  Top Layer w0.254: 8.81,36.49 v1(8.81,36.74) ; 8.81,36.49 8.56,36.24 ; 8.81,36.49 v1(8.81,35.98) 8.56,36.24 ; 8.56,36.24 U4.5 ; 16.06,30.52 16.43,30.15 16.43,29.37 R18.2 16.93,27.35 R31.2
  Top Layer w0.384: 15.16,30.52 v1(14.78,30.9) v1(14.78,30.14) 15.16,30.52 ; 15.16,30.52 16.06,30.52
  Top Layer w0.406: C66.1 22.52,26.46 21.26,26.46 20.56,27.15 C32.1 19.03,27.08 R31.2
  Bottom Layer w0.254: v1(8.81,36.74) v1(8.81,35.98) 8.81,35.09 13,30.9 v1(14.78,30.9)
  Bottom Layer w0.384: v1(14.78,30.14) v1(14.78,30.9)
$1N129: length 6.6
  Top Layer w0.254: R27.2 15.67,32.67 15.67,33.03 15.26,33.44 13.76,33.44 13.51,33.7 U4.2
  Top Layer w0.384: R27.2 R26.2
$1N130: length 6.4
  Top Layer w0.254: R27.1 14.41,32.43 U4.1 11.99,32.33 R28.1 R33.2
$1N131: length 8.6
  Top Layer w0.254: R33.1 8.69,31.67 9.06,32.04 9.06,33.7 7.79,34.97 U4.6 4.48,34.97 R34.2
$1N132: length 4
  Top Layer w0.254: U4.7 6.37,33.58 R34.1 4.36,31.8 R41.1
$1N134: length 2.8
  Top Layer w0.254: C73.1 2.85,29.51 R41.2
$1N141: length 2.6
  Top Layer w0.406: 2.97,10.97 2.97,8.69 C71.1
$1N143: length 4
  Top Layer w0.406: 4.47,10.97 4.36,11.08 R43.1 4.48,12.87 U2.7
$1N144: length 8.7
  Top Layer w0.254: R44.1 8.69,10.46 9.06,10.84 9.06,12.99 7.92,14.14 6.48,14.14
  Top Layer w0.406: 6.48,14.14 6.37,14.26 R43.2
$1N145: length 6.4
  Top Layer w0.254: R44.2 R51.1 11.99,11.5 U2.1 14.53,11.6
$1N146: length 26.4
  Top Layer w0.254: 7.75,15.53 8.17,15.53 ; 7.75,15.53 7.37,15.53 ; 7.75,15.53 8.17,15.53 ; 8.17,15.53 8.43,15.53 ; 8.43,15.53 8.68,15.53 8.81,15.41 ; 8.43,15.53 v1(8.81,15.92) 8.81,15.41 ; R32.2 17.15,6.3 17.15,8.26 R23.2 16.56,8.41 16.56,9.07 16.12,9.5 ; v1(14.78,10.07) v1(14.78,9.31) ; v1(8.81,15.15) 8.81,15.41
  Top Layer w0.384: 15.16,9.69 R50.1 16.12,9.5 ; 15.16,9.69 v1(14.78,9.31) ; 15.16,9.69 v1(14.78,10.07)
  Top Layer w0.406: R32.2 18.92,6.25 20.69,4.48 C67.1
  Bottom Layer w0.254: v1(8.81,15.92) v1(8.81,15.15) 8.81,14.26 13,10.07 v1(14.78,10.07) v1(14.78,9.31)
$1N148: length 6.5
  Top Layer w0.254: R46.2 R45.2 ; U2.2 13.64,12.87 13.89,12.61 15.29,12.61 15.67,12.23 15.67,11.97 16.04,11.6
$1N150: length 13.2
  Top Layer w0.254: 11.89,14.14 13.25,14.14 14.14,13.25 15.67,13.25 15.92,12.99 v2(16.56,12.99) v2(17.32,12.99) ; R49.2 18.99,9.94 18.69,9.94 18.68,9.95 v2(18.33,9.95) ; v2(18.33,9.95) v2(18.33,9.18) ; v2(18.33,9.95) 17.83,9.95 17.82,9.94
  Bottom Layer w0.254: v2(18.33,9.18) v2(18.33,9.95) 17.83,10.45 17.83,12.49 v2(17.32,12.99) v2(16.56,12.99)
$1N162: length 15.2
  Bottom Layer w0.384: 36.43,62.77 36.43,63.67 ; 36.43,62.77 36.43,62.67 ; 36.43,62.77 36.52,63.57 ; 36.43,63.67 U9.1 36.68,63.86 36.93,63.62 36.93,63.17 ; 36.43,63.67 36.52,63.57 ; 36.43,61.12 36.43,62.22 ; 36.43,61.12 35.61,61.94 ; 36.43,61.12 L5.1 36.93,62.43 ; 36.43,62.22 36.15,61.94 35.7,61.94 ; 36.43,62.22 36.43,62.67 ; 36.43,62.22 36.79,62.57 ; 36.93,63.17 36.93,62.98 ; 36.93,63.17 36.73,62.97 ; 36.93,63.17 36.73,63.37 ; 36.52,63.57 36.73,63.37 ; 36.73,63.37 36.73,62.97 ; 35.61,61.94 35.7,61.94 ; 35.61,61.94 D2.2 ; 35.7,61.94 36.43,62.67 ; 36.43,62.67 36.54,62.78 ; 36.73,62.97 36.54,62.78 ; 36.54,62.78 36.58,62.78 36.79,62.57 ; 36.93,63.17 36.93,62.43 ; 36.93,62.43 36.79,62.57
$1N168: length 5.3
  Bottom Layer w0.384: 34.72,65.53 34.72,65.76 ; 34.72,65.53 R48.1 34.72,64.93 ; 34.72,65.53 34.95,65.76 ; 34.72,65.76 34.72,66.01 ; 34.72,65.76 34.95,65.76 ; 34.96,65.76 34.95,65.76 ; 34.96,65.76 34.72,66.01 ; 34.96,65.76 U9.3 ; 34.72,66.01 34.72,66.47
  Bottom Layer w0.512: R62.2 R48.1
$1N169: length 5.7
  Top Layer w0.254: 52.11,6.84 52.11,7.21 ; 52.11,6.84 R9.2 52.11,7.21 ; 52.11,6.84 52.11,6.85 ; 52.11,6.84 52.11,5.12 ; 52.11,7.21 52.29,7.03 52.12,7.03 52.11,6.85 ; 52.11,6.85 52.29,7.03 U7.3
$1N170: length 10.2
  Top Layer w0.254: R10.2 R47.2 52.88,25.57 53.89,24.55 53.89,22.64 R_DRE.2 ; R10.2 52.11,27.63 52.39,27.35 ; R10.2 52.39,27.35 ; 52.39,27.35 U5.3
$1N172: length 15
  Top Layer w0.384: R_HP.2 57.13,78.33 L8.1 57.7,80.37 J4.4
  Bottom Layer w0.358: J4.4 61.88,74.07 63.17,75.35 63.17,78.78 61.58,80.37 J4.4
$1N177: length 13.1
  Top Layer w0.384: 57.56,76.38 57.97,76.38 58.47,76.88 58.47,78.4 59.1,79.03 63.32,79.03 J4.3 ; 57.56,76.38 56.69,76.38 57.13,75.93 ; 57.56,76.38 57.13,75.95 57.13,75.93 ; 57.13,75.93 NOREF.1
$1N182: length 5
  Bottom Layer w0.254: R1.2 R54.2 45.64,79.04 46.14,79.04 ; 46.15,79.04 46.4,79.29 46.49,79.29 U3.1 ; 46.15,79.04 U3.1 ; 46.15,79.04 46.14,79.04 ; U3.1 46.48,78.78 46.4,78.78 46.14,79.04
$1N183: length 10.1
  Top Layer w0.254: v1(46.53,77.26) 46.53,79.16 45.63,80.06 42.72,80.06
  Bottom Layer w0.254: R2.2 v1(42.72,80.05) R12.2 ; v1(46.53,77.26) 47.39,78.12 47.39,79.04
$1N186: length 4.3
  Bottom Layer w0.254: 49.99,79.04 49.99,80.21 50.34,80.56 51.1,80.56 52.3,79.35 52.3,79.16
$1N188: length 3.3
  Bottom Layer w0.254: C49.1 51.54,76.94 50.64,77.85 U3.7
$1N189: length 3.3
  Bottom Layer w0.254: U3.8 50.64,74.63 51.54,75.54 C49.2
$1N190: length 13.4
  Bottom Layer w0.254: 50.34,72.05 51.1,72.05 52.3,73.25 52.3,73.45 ; 50.34,72.05 49.99,72.4 49.99,77.23 49.34,77.88 49.34,79.04 ; 50.34,72.05 50.3,72.05 49.96,71.7 ; 50.08,72.05 50.24,72.05 ; 49.96,71.7 49.96,73.41 U3.9 ; 49.96,71.7 L7.1
$1N192: length 3.7
  Bottom Layer w0.254: 46.22,73.95 R55.2 R56.1 ; 46.22,73.95 46.53,73.95 ; 46.22,73.95 U3.14
$1N196: length 5.2
  Bottom Layer w0.254: 47.39,73.44 47.39,72.27 47.16,72.05 46.27,72.05 45.89,72.43 45.12,72.43 ; R59.1 R29.1
$1N203: length 3.9
  Top Layer w0.512: SW1.7 49.62,63.03 L10.1
$1N209: length 9.2
  Top Layer w0.384: P1.13 26.42,53.08 v1(26.46,53.13)
  Bottom Layer w0.384: v1(26.46,53.13) 27.05,53.71 L13.2
$1N233: length 5.1
  Bottom Layer w0.254: 35.95,29.84 35.96,29.25 36.34,28.87 37.36,28.87 38.76,27.47 L6.2
$1N236: length 6.4
  Top Layer w0.254: R60.1 54.04,31.41 53.64,31.41 53.01,30.78 ; 53.01,30.78 R57.1 ; 53.01,30.78 52.75,30.52 52.75,29.5 53.64,28.62 U5.2
$1N239: length 5.6
  Top Layer w0.254: R61.1 53.91,11.22 53.67,11.22 52.88,10.42 52.88,9.18 53.77,8.3 U7.2
$1N244: length 1.8
  Bottom Layer w0.512: L14.1 59.39,71.26 SW1.E
$1N6334: length 5.9
  Bottom Layer w0.254: R63.2 34.58,4.37 35.1,3.85 37.26,3.85 38.17,4.77 38.17,6.03
$1N6335: length 6.7
  Bottom Layer w0.254: 41.17,6.03 41.19,6 41.19,4.61 42.08,3.72 44.11,3.72 44.88,2.96 45.27,2.96 45.64,2.59
$1N9655: length 5
  Top Layer w0.254: 62.56,15.2 62.53,15.16 62.53,12.37 62.67,12.23 62.53,12.1 R39.2
$1N12613: length 5.1
  Top Layer w0.254: R25.2 62.53,32.42 62.67,32.55 62.53,32.69 62.53,35.48 C59.1
$1N12712: length 5.7
  Top Layer w0.254: R57.2 52.73,32.29 54.26,33.82 55.55,33.82 55.92,34.19 C60.1
$1N12761: length 5.8
  Top Layer w0.254: C61.1 56.04,14 55.55,13.5 54.15,13.5 52.62,11.97 R58.2
$1N12936: length 3.2
  Top Layer w0.254: J6.6 51.37,2.89 C64.2
$1N12941: length 3.5
  Top Layer w0.254: 48.49,5.57 48.18,5.88 C64.1 48.76,5.5 50.22,5.5 50.6,5.12
$1N12984: length 2.8
  Top Layer w0.254: C65.2 51,23.22
$1N12989: length 2.8
  Top Layer w0.254: C65.1 48.77,25.82 50.35,25.82 R47.1
$1N13475: length 6.5
  Top Layer w0.254: 15.28,15.03 15.28,14.27 15.67,13.88 17.83,13.88 19.21,12.5 R46.1
$1N13529: length 3.9
  Top Layer w0.254: R49.1 21.64,10.59 21.64,11.09 22.52,11.98 C69.1
$1N13586: length 4.5
  Top Layer w0.254: R51.2 13.13,9.32 13.13,6.64 12.75,6.26 11.99,6.26
$1N13708: length 27.6
  Top Layer w0.254: 17.94,2.74 15.51,2.74 14.14,4.1 10.59,4.1 9.83,4.87 9.83,6.01 9.44,6.39 C70.2
  Bottom Layer w0.254: 19.86,18.96 19.86,2.76
$1N13767: length 36.7
  Top Layer w0.254: J8.5 10.56,2.74 8.68,4.61 3.72,4.61 C71.2
  Bottom Layer w0.254: 12.9,18.94 14.27,17.57 18.21,17.57 19.35,16.42 19.35,5.5 18.46,4.61 14.75,4.61 J8.5
$1N13875: length 37.2
  Top Layer w0.254: C73.2 8.69,25.81 10.08,24.42 11.63,24.42 J7.5
  Bottom Layer w0.254: J7.4 14.24,38.01 18.33,38.01 19.35,37 19.35,25.31 18.59,24.55 14.24,24.55 J7.5
$1N13898: length 4.4
  Top Layer w0.254: C72.1 12.75,27.22 13.13,27.6 13.13,30.15 R28.2
$1N13906: length 28.7
  Top Layer w0.254: C72.2 9.32,27.22 9.7,26.84 9.7,26.19 10.45,25.44 13.38,25.44 15.41,23.41 18.95,23.41 J7.7
  Bottom Layer w0.254: 19.86,39.41 19.86,23.21
$1N13999: length 3.5
  Top Layer w0.254: R22.1 22.65,32.43 C75.1
$1N14034: length 6.7
  Top Layer w0.254: R26.1 19.21,33.58 18.08,34.71 15.54,34.71 15.15,35.1 C74.1

## Copper pours and planes (outline as drawn; the poured copper is in the pictures)
GND on Top Layer: -10.29,89.41 81.66,89.41 82.17,89.92 82.17,1.91 95.5,-11.43 -11.56,-11.43 -16,-6.98 -15.88,-6.98 -15.75,-7.11
GND on Bottom Layer: -7.07,88.43 84.88,88.43 86.15,89.7 86.15,0.17 98.73,-12.41 -8.34,-12.41 -12.78,-7.96 -12.65,-7.96 -12.53,-8.09
ISOLATE_DRE on Top Layer: 54.66,32.81 56.69,32.81 56.69,31.28 54.66,31.28
ISOLATE_DRE on Top Layer: 54.53,12.61 56.56,12.61 56.56,11.09 54.53,11.09
ISOLATE_HP on Bottom Layer: 54.78,80.81 58.47,80.81 58.47,73.7 54.78,73.7

## Text on the board
Top Silkscreen Layer: L | R | Short for | Parallel IN | HP_routing | Gain | Grounding | Chassis | Footswitch | Mini-Stomp-X | v3.3
